# Altium schematic sheet stm8电机控制原理图.SchDoc
size A3
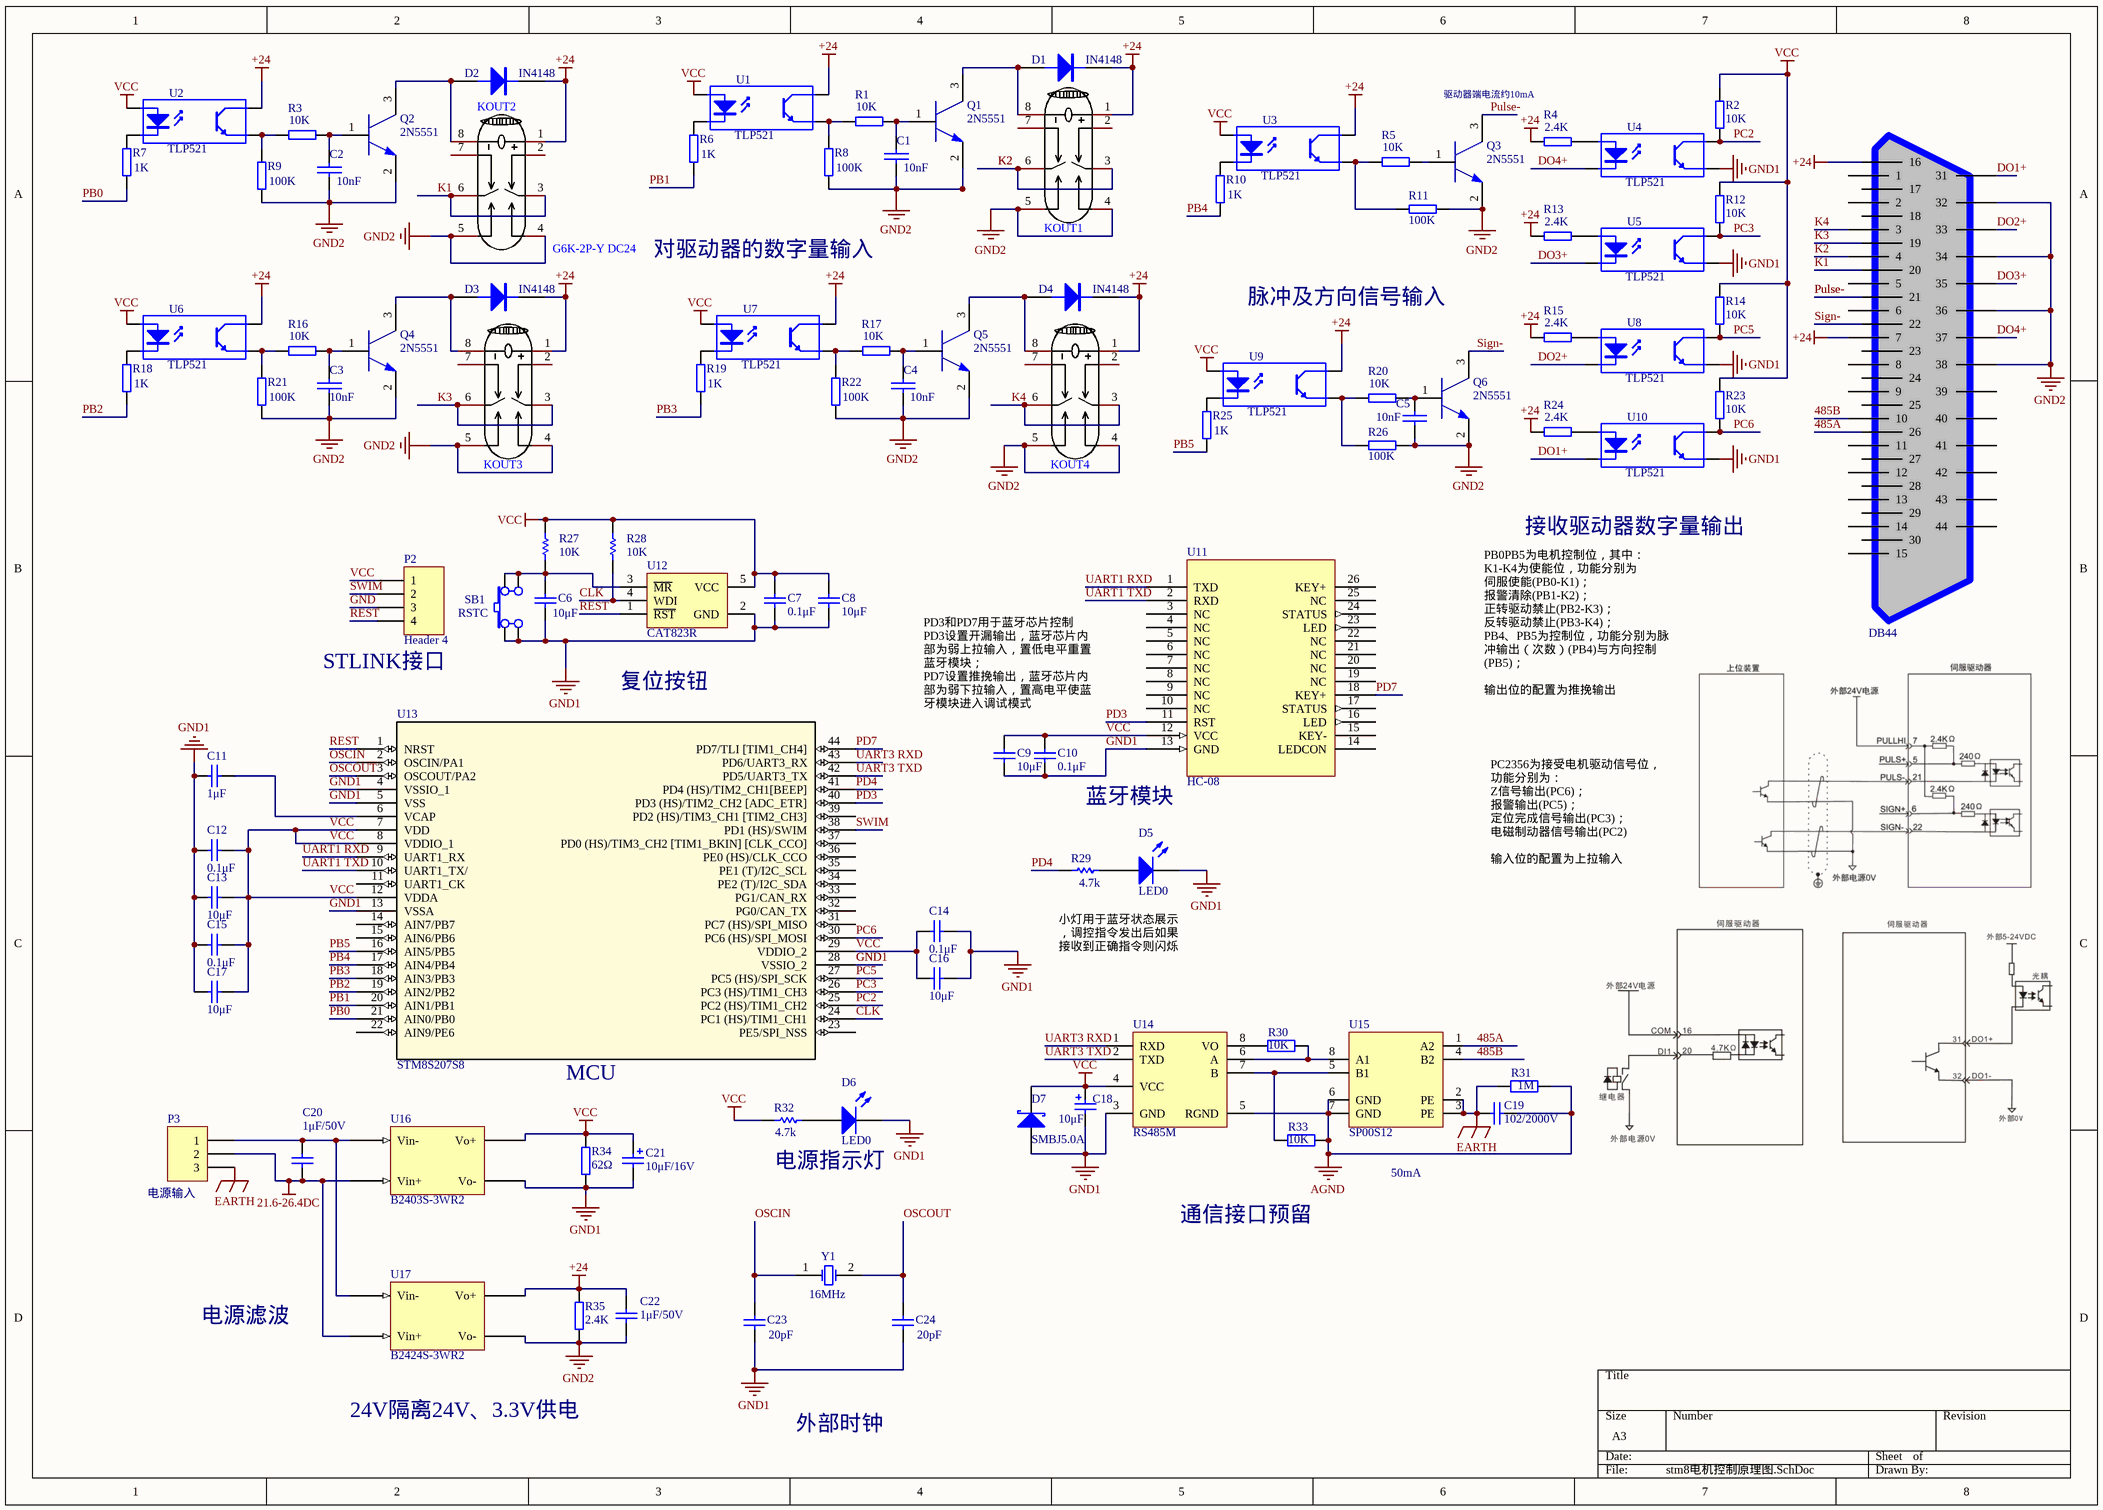
[diagram p0: stm8电机控制原理图.SchDoc]

## Parts
C1  value 10nF  [C 0603_L]
C2  value 10nF  [C 0603_L]
C3  value 10nF  [C 0603_L]
C4  value 10nF  [C 0603_L]
C5  value 10nF  [C 0603_L]
C6  value 10μF  [C 0603_L]
C7  value 0.1μF  [C 0603_L]
C8  value 10μF  [C 0603_L]
C9  value 10μF  [C 0603_L]
C10  value 0.1μF  [C 0603_L]
C11  value 1μF  [C 0603_L]
C12  value 0.1μF  [C 0603_L]
C13  value 10μF  [C 0603_L]
C14  value 0.1μF  [C 0603_L]
C15  value 0.1μF  [C 0603_L]
C16  value 10μF  [C 0603_L]
C17  value 10μF  [C 0603_L]
C18  value 10μF  [C 0603_L]
C19  value 102/2000V  [RAD0.6]
C20  value 1μF/50V  [C 1206_L]
C21  value 10μF/16V  [SMD-EC-F4]  (hidden comment: Cap Pol2)
C22  value 1μF/50V  [C 1206_L]
C23  value 20pF  [C 0603_L]
C24  value 20pF  [C 0603_L]
D1  IN4148  [DO-214AC]
D2  IN4148  [DO-214AC]
D3  IN4148  [DO-214AC]
D4  IN4148  [DO-214AC]
D5  LED0  [LED 0603R]
D6  LED0  [LED 0603R]
D7  SMBJ5.0A  [DO-214AA]
KOUT1  G6K-2P-Y DC24  [RELAY-TH_G6K-2P-Y]  (value not drawn)
KOUT2  G6K-2P-Y DC24  [RELAY-TH_G6K-2P-Y]
KOUT3  G6K-2P-Y DC24  [RELAY-TH_G6K-2P-Y]  (value not drawn)
KOUT4  G6K-2P-Y DC24  [RELAY-TH_G6K-2P-Y]  (value not drawn)
P1  DB44  [DSUB-TH_DS1038-44FBNSIA74-0CC]
P2  Header 4  [XH2.54-LI-4P]
P3  电源输入  [3PDZ]
Q1  2N5551  [SOT-23]
Q2  2N5551  [SOT-23]
Q3  2N5551  [SOT-23]
Q4  2N5551  [SOT-23]
Q5  2N5551  [SOT-23]
Q6  2N5551  [SOT-23]
R1  value 10K  [R 0603_L]
R2  value 10K  [R 0603_L]
R3  value 10K  [R 0603_L]
R4  value 2.4K  [R 0603_L]
R5  value 10K  [R 0603_L]
R6  value 1K  [R 0603_L]
R7  value 1K  [R 0603_L]
R8  value 100K  [R 0603_L]
R9  value 100K  [R 0603_L]
R10  value 1K  [R 0603_L]
R11  value 100K  [R 0603_L]
R12  value 10K  [R 0603_L]
R13  value 2.4K  [R 0603_L]
R14  value 10K  [R 0603_L]
R15  value 2.4K  [R 0603_L]
R16  value 10K  [R 0603_L]
R17  value 10K  [R 0603_L]
R18  value 1K  [R 0603_L]
R19  value 1K  [R 0603_L]
R20  value 10K  [R 0603_L]
R21  value 100K  [R 0603_L]
R22  value 100K  [R 0603_L]
R23  value 10K  [R 0603_L]
R24  value 2.4K  [R 0603_L]
R25  value 1K  [R 0603_L]
R26  value 100K  [R 0603_L]
R27  value 10K  [R 0603_L]
R28  value 10K  [R 0603_L]
R29  value 4.7k  [R 0603_L]
R30  value 10K  [R 0603_L]
R31  value 1M  [R 2512_L]
R32  value 4.7k  [R 0603_L]
R33  value 10K  [R 0603_L]
R34  value 62Ω  [R 2512_L]
R35  value 2.4K  [R 2512_L]
SB1  RSTC  [按键4P]
U1  TLP521  [SMD521-1]
U2  TLP521  [SMD521-1]
U3  TLP521  [SMD521-1]
U4  TLP521  [SMD521-1]
U5  TLP521  [SMD521-1]
U6  TLP521  [SMD521-1]
U7  TLP521  [SMD521-1]
U8  TLP521  [SMD521-1]
U9  TLP521  [SMD521-1]
U10  TLP521  [SMD521-1]
U11  HC-08  [HC-22/08/42新_SMT2]
U12  CAT823R  [SOT23-5]
U13  STM8S207S8  [LQFP-44]
U14  RS485M  [RS485M]
U15  SP00S12  [RS485M]
U16  B2403S-3WR2  [B2403S-2WR3]
U17  B2424S-3WR2  [B2403S-2WR3]
Y1  value 16MHz  [SMD-5032_2P]

## Nets
21.6-26.4DC: C20.1 P3.2 U16.1(Vin+) U17.1(Vin+)
+24: C22.2 D1.2(K) D2.2(K) D3.2(K) D4.2(K) KOUT1.1 KOUT2.1 KOUT3.1 KOUT4.1 P1.7 P1.16 R4.2 R13.2 R15.2 R24.2 R35.1 U1.4(C) U2.4(C) U3.4(C) U6.4(C) U7.4(C) U9.4(C) U17.4(Vo+)
AGND: C19.1 R31.1 R33.1 U14.5(RGND) U15.6(GND) U15.7(GND)
EARTH: C19.2 P3.3 R31.2 U15.2(PE) U15.3(PE)
GND: C6.2 C7.1 C8.1 C9.1 C10.1 C11.1 C12.1 C13.1 C14.2 C15.1 C16.2 C17.1 C18.2 C21.2 C23.1 C24.1 D5.2(K) D6.2(K) D7.1(A) P2.3 R34.2 SB1.1(I2) SB1.2(I3) U4.3(E) U5.3(E) U8.3(E) U10.3(E) U11.13(GND) U12.2(GND) U13.4(VSSIO_1) U13.5(VSS) U13.13(VSSA) U13.28(VSSIO_2) U14.3(GND) U16.3(Vo-)  [also labelled GND1]
GND2: C1.2 C2.2 C3.2 C4.2 C5.2 C22.1 KOUT1.4 KOUT1.5 KOUT2.4 KOUT2.5 KOUT3.4 KOUT3.5 KOUT4.4 KOUT4.5 P1.32 P1.34 P1.36 P1.38 Q1.2(e) Q2.2(e) Q3.2(e) Q4.2(e) Q5.2(e) Q6.2(e) R8.1 R9.1 R11.1 R21.1 R22.1 R26.1 R35.2 U17.3(Vo-)
VCC: C7.2 C8.2 C9.2 C10.2 C12.2 C13.2 C14.1 C15.2 C16.1 C17.2 C18.1 C21.1 D7.2(K) P2.1 R2.1 R12.1 R14.1 R23.1 R27.1 R28.1 R32.1 R34.1 U1.1(A) U2.1(A) U3.1(A) U6.1(A) U7.1(A) U9.1(A) U11.12(VCC) U12.5(VCC) U13.7(VDD) U13.8(VDDIO_1) U13.12(VDDA) U13.29(VDDIO_2) U14.4(VCC) U16.4(Vo+)
485A: P1.26 U15.1(A2)
485B: P1.10 U15.4(B2)
CLK: R28.2 U12.4(WDI) U13.24(PC1_(HS)/TIM1_CH1)
DO1+: P1.31 U10.2(K)
DO2+: P1.33 U8.2(K)
DO3+: P1.35 U5.2(K)
DO4+: P1.37 U4.2(K)
K1: KOUT2.3 KOUT2.6 P1.20
K2: KOUT1.3 KOUT1.6 P1.4
K3: KOUT3.3 KOUT3.6 P1.19
K4: KOUT4.3 KOUT4.6 P1.3
OSCIN: C23.2 U13.2(OSCIN/PA1) Y1.1(OSC1)
OSCOUT: C24.2 U13.3(OSCOUT/PA2) Y1.2(OSC2)
PB0: R7.1 U13.21(AIN0/PB0)
PB1: R6.1 U13.20(AIN1/PB1)
PB2: R18.1 U13.19(AIN2/PB2)
PB3: R19.1 U13.18(AIN3/PB3)
PB4: R10.1 U13.17(AIN4/PB4)
PB5: R25.1 U13.16(AIN5/PB5)
PC2: R2.2 U4.4(C) U13.25(PC2_(HS)/TIM1_CH2)
PC3: R12.2 U5.4(C) U13.26(PC3_(HS)/TIM1_CH3)
PC5: R14.2 U8.4(C) U13.27(PC5_(HS)/SPI_SCK)
PC6: R23.2 U10.4(C) U13.30(PC6_(HS)/SPI_MOSI)
PD3: U11.11(RST) U13.40(PD3_(HS)/TIM2_CH2_[ADC_ETR])
PD4: R29.1 U13.41(PD4_(HS)/TIM2_CH1[BEEP])
PD7: U11.18(KEY+) U13.44(PD7/TLI_[TIM1_CH4])
Pulse: P1.21 Q3.3(c)  [also labelled Pulse-]
REST: P2.4 U12.1(~{RST}) U13.1(NRST)
Sign-: P1.22 Q6.3(c)
SWIM: P2.2 U13.38(PD1_(HS)/SWIM)
UART1 RXD: U11.1(TXD) U13.9(UART1_RX)
UART1 TXD: U11.2(RXD) U13.10(UART1_TX/)
UART3 RXD: U13.43(PD6/UART3_RX) U14.1(RXD)
UART3 TXD: U13.42(PD5/UART3_TX) U14.2(TXD)
NetC1_1: C1.1 Q1.1(b) R1.1
NetC2_1: C2.1 Q2.1(b) R3.1
NetC3_1: C3.1 Q4.1(b) R16.1
NetC4_1: C4.1 Q5.1(b) R17.1
NetC5_1: C5.1 Q6.1(b) R20.1
NetC6_1: C6.1 R27.2 SB1.3 SB1.4(I1) U12.3(~{MR})
NetC11_2: C11.2 U13.6(VCAP)
NetC20_2: C20.2 P3.1 U16.2(Vin-) U17.2(Vin-)
NetD1_1: D1.1(A) KOUT1.8 Q1.3(c)
NetD2_1: D2.1(A) KOUT2.8 Q2.3(c)
NetD3_1: D3.1(A) KOUT3.8 Q4.3(c)
NetD4_1: D4.1(A) KOUT4.8 Q5.3(c)
NetD5_1: D5.1(A) R29.2
NetD6_1: D6.1(A) R32.2
NetQ3_1: Q3.1(b) R5.1
NetR1_2: R1.2 R8.2 U1.3(E)
NetR3_2: R3.2 R9.2 U2.3(E)
NetR4_1: R4.1 U4.1(A)
NetR5_2: R5.2 R11.2 U3.3(E)
NetR6_2: R6.2 U1.2(K)
NetR7_2: R7.2 U2.2(K)
NetR10_2: R10.2 U3.2(K)
NetR13_1: R13.1 U5.1(A)
NetR15_1: R15.1 U8.1(A)
NetR16_2: R16.2 R21.2 U6.3(E)
NetR17_2: R17.2 R22.2 U7.3(E)
NetR18_2: R18.2 U6.2(K)
NetR19_2: R19.2 U7.2(K)
NetR20_2: R20.2 R26.2 U9.3(E)
NetR24_1: R24.1 U10.1(A)
NetR25_2: R25.2 U9.2(K)
NetR30_1: R30.1 U14.6(A) U15.8(A1)
NetR30_2: R30.2 U14.8(VO)
NetR33_2: R33.2 U14.7(B) U15.5(B1)

Not connected (* = marked no-connect by the designer): KOUT1 2 7; KOUT2 2 7; KOUT3 2 7; KOUT4 2 7; P1 1 2 5 6 8 9 11 12 13 14 15 17 18 23 24 25 27 28 29 30 39 40 41 42 43 44; U11 3(NC) 4(NC) 5(NC) 6(NC) 7(NC) 8(NC) 9(NC) 10(NC) 14(LEDCON) 15(KEY-) 16(LED) 17(STATUS) 19(NC) 20(NC) 21(NC) 22(NC) 23(LED) 24(STATUS) 25(NC) 26(KEY+); U13 11(UART1_CK) 14(AIN7/PB7) 15(AIN6/PB6) 22(AIN9/PE6) 23(PE5/SPI_NSS) 31(PC7_(HS)/SPI_MISO) 32(PG0/CAN_TX) 33(PG1/CAN_RX) 34(PE2_(T)/I2C_SDA) 35(PE1_(T)/I2C_SCL) 36(PE0_(HS)/CLK_CCO) 37(PD0_(HS)/TIM3_CH2_[TIM1_BKIN]_[CLK_CCO]) 39(PD2_(HS)/TIM3_CH1_[TIM2_CH3])

## Notes on the sheet
- 驱动器端电流约10mA
- 对驱动器的数字量输入
- 脉冲及方向信号输入
- 接收驱动器数字量输出
- (near P2) STLINK接口
- 复位按钮
- PD3和PD7用于蓝牙芯片控制
  PD3设置开漏输出，蓝牙芯片内部为弱上拉输入，置低电平重置蓝牙模块；
  PD7设置推挽输出，蓝牙芯片内部为弱下拉输入，置高电平使蓝牙模块进入调试模式
- PB0PB5为电机控制位，其中：
  K1-K4为使能位，功能分别为
  伺服使能(PB0-K1)；
  报警清除(PB1-K2)；
  正转驱动禁止(PB2-K3)；
  反转驱动禁止(PB3-K4)；
  PB4、PB5为控制位，功能分别为脉冲输出（次数）(PB4)与方向控制(PB5)；
  输出位的配置为推挽输出
- 蓝牙模块
- PC2356为接受电机驱动信号位，功能分别为：
  Z信号输出(PC6)；
  报警输出(PC5)；
  定位完成信号输出(PC3)；
  电磁制动器信号输出(PC2)
  输入位的配置为上拉输入
- 小灯用于蓝牙状态展示，调控指令发出后如果接收到正确指令则闪烁
- (near U13) MCU
- 电源指示灯
- 50mA
- 通信接口预留
- 电源滤波
- 24V隔离24V、3.3V供电
- 外部时钟

## Library data of the parts
C1-C5 = CAP: Capacitor
C6-C17 C19 C20 C22-C24 = Cap: Capacitor; Published: 8-Jun-2000; LatestRevisionDate: 17-Jul-2002; LatestRevisionNote: Re-released for DXP Platform.; PackageReference: RAD-0.3; Publisher: Altium Limited; PackageDescription: Radial Cap, Thru-Hole; 2 Leads; 0.3 in Pin Spacing
C18 = Cap Pol1: Polarized Capacitor (Radial); Published: 8-Jun-2000; LatestRevisionDate: 17-Jul-2002; LatestRevisionNote: Re-released for DXP Platform.; PackageReference: RB7.6-15; Publisher: Altium Limited; PackageDescription: Polarized Capacitor (Radial); 2 Leads
C21 = Cap Pol2: Polarized Capacitor (Axial); Published: 8-Jun-2000; LatestRevisionDate: 17-Jul-2002; LatestRevisionNote: Re-released for DXP Platform.; PackageReference: POLAR0.8; Publisher: Altium Limited; PackageDescription: Polarized Capacitor; 2 Leads
D1-D4 = DIODE
D5 D6 = LED0: Typical INFRARED GaAs LED; Published: 8-Jun-2000; LatestRevisionDate: 08-Jul-2005; LatestRevisionNote: Mech Layer 1 removed.; PackageReference: LED-0; Publisher: Altium Limited; PackageDescription: LED; 2 Leads
D7 = D Schottky: Schottky Diode; Published: 8-Jun-2000; LatestRevisionDate: 17-Jul-2002; LatestRevisionNote: Re-released for DXP Platform.; PackageReference: SMB; Publisher: Altium Limited; PackageDescription: DO-214-AA/SMB; 2 C-Bend Leads; Body 5.3 x 3.6 mm, inc. leads (LxW); Code_JEDEC: DO-214-AA
KOUT1-KOUT4 = G6K-2P-Y DC24: Manufacturer: OMRON(欧姆龙); Add into BOM: yes; Symbol: G6K-2P-Y DC24; Device: G6K-2P-Y DC24; LCSC Part Name: 24V DPDT; Supplier Part: C397136; Manufacturer Part: G6K-2P-Y DC24; Supplier Footprint: 插件; JLCPCB Part Class: Extended Part; Datasheet: https://atta.szlcsc.com/upload/public/pdf/source/20190906/C397136_6F302552CB638852A1EF2D3927A5DC73.pdf; Supplier: LCSC; Convert to PCB: yes
P1 = DB44_1
P2 = Header 4: Header, 4-Pin; LatestRevisionDate: 17-Jul-2002; LatestRevisionNote: Re-released for DXP Platform.; Publisher: Altium Limited
P3 = Header 3: Header, 3-Pin; LatestRevisionDate: 17-Jul-2002; LatestRevisionNote: Re-released for DXP Platform.; Publisher: Altium Limited
Q1-Q6 = 9014
R1-R26 R34 R35 = RES2
R27-R29 R32 = Res1: Resistor; Published: 8-Jun-2000; LatestRevisionDate: 17-Jul-2002; LatestRevisionNote: Re-released for DXP Platform.; PackageReference: AXIAL-0.3; Publisher: Altium Limited; PackageDescription: Axial Device, Thru-Hole; 2 Leads; 0.3 in Pin Spacing
R30 R31 R33 = Res2: Resistor; Published: 8-Jun-2000; LatestRevisionDate: 17-Jul-2002; LatestRevisionNote: Re-released for DXP Platform.; PackageReference: AXIAL-0.4; Publisher: Altium Limited; PackageDescription: Axial Device, Thru-Hole; 2 Leads; 0.4 in Pin Spacing
SB1 = SW-TACT
U11 = Bluetooth
U12 = CAT823
U13 = STM8S208S8T6: No Description Available; Mfr_Name: STMicroelectronics; Copyright: Copyright (C) 2022 Ultra Librarian. All rights reserved.; Manufacturer_Part_Number: STM8S208S8T6; RefDes: RefDes; Type: DEV
U16 = isolation
U17 = B2403S-2W3R
Y1 = XTAL: Crystal Oscillator; Published: 8-Jun-2000; LatestRevisionDate: 17-Jul-2002; LatestRevisionNote: Re-released for DXP Platform.; PackageReference: R38; Publisher: Altium Limited; PackageDescription: Crystal, Thru-Hole; 2 Leads; Body 3.1 x 8.2 mm (Dia.xH)